# Altium project OlivettiISARiser.PrjPcb
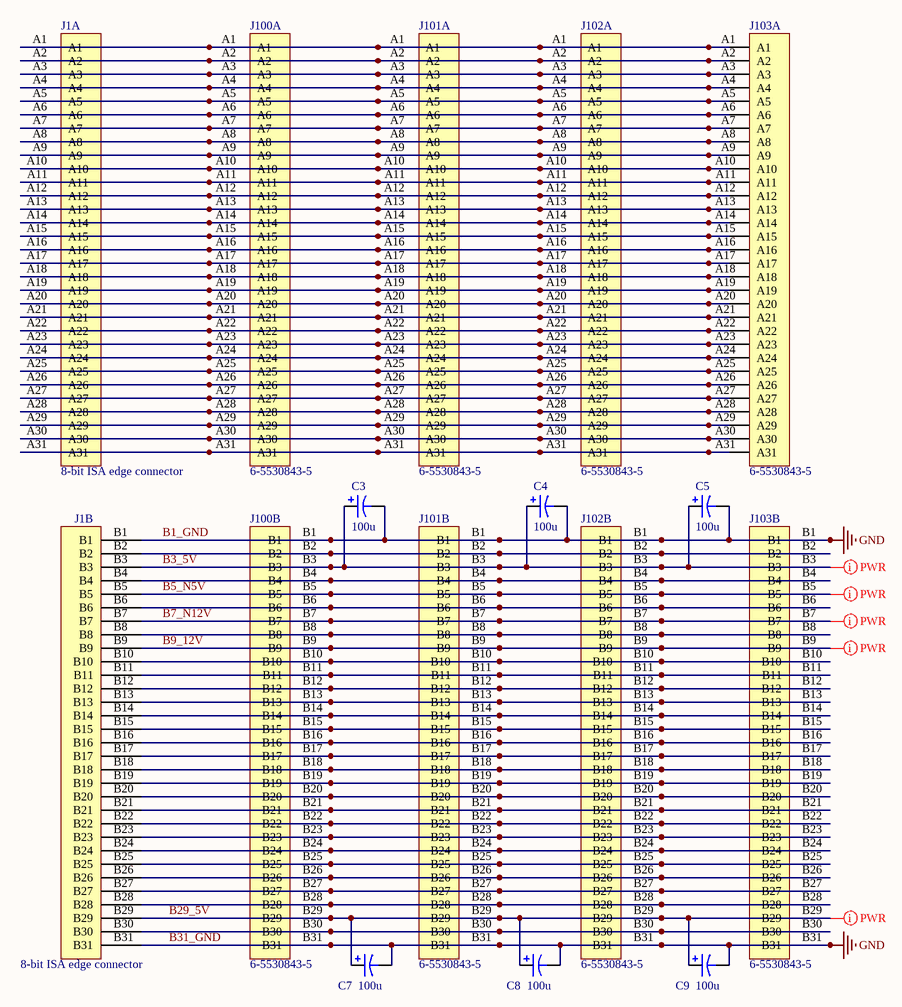
[diagram p0: Riser.SchDoc]
1 sheet, 11 parts. Net scope: global (net labels, ports and power ports of the same name join across sheets).
Board file: Riser.PcbDoc

## Sheet Riser.SchDoc
size A4; SheetNumber: 1; SheetTotal: 1

### Parts
C3  100u  [CAP-6.3-2.5]
C4  100u  [CAP-6.3-2.5]
C5  100u  [CAP-6.3-2.5]
C7  100u  [CAP-6.3-2.5]
C8  100u  [CAP-6.3-2.5]
C9  100u  [CAP-6.3-2.5]
J1  8-bit ISA edge connector  [ISA-EDGE-62]  (parts A,B of 2)  (no BOM)
J100  6-5530843-5  [CONN62_6-5530843-5_TEC]  (parts A,B of 2)
J101  6-5530843-5  [CONN62_6-5530843-5_TEC]  (parts A,B of 2)
J102  6-5530843-5  [CONN62_6-5530843-5_TEC]  (parts A,B of 2)
J103  6-5530843-5  [CONN62_6-5530843-5_TEC]  (parts A,B of 2)

### Nets
B1_GND: C3.2 C4.2 C5.2 C7.2 C8.2 C9.2 J1.B1 J1.B31 J100.B1 J100.B31 J101.B1 J101.B31 J102.B1 J102.B31 J103.B1 J103.B31  [also labelled B31_GND, GND]
B3_5V: C3.1 C4.1 C5.1 J1.B3 J100.B3 J101.B3 J102.B3 J103.B3
B5_N5V: J1.B5 J100.B5 J101.B5 J102.B5 J103.B5
B7_N12V: J1.B7 J100.B7 J101.B7 J102.B7 J103.B7
B9_12V: J1.B9 J100.B9 J101.B9 J102.B9 J103.B9
B29_5V: C7.1 C8.1 C9.1 J1.B29 J100.B29 J101.B29 J102.B29 J103.B29
NetJ1_A1: J1.A1 J100.A1 J101.A1 J102.A1 J103.A1
NetJ1_A2: J1.A2 J100.A2 J101.A2 J102.A2 J103.A2
NetJ1_A3: J1.A3 J100.A3 J101.A3 J102.A3 J103.A3
NetJ1_A4: J1.A4 J100.A4 J101.A4 J102.A4 J103.A4
NetJ1_A5: J1.A5 J100.A5 J101.A5 J102.A5 J103.A5
NetJ1_A6: J1.A6 J100.A6 J101.A6 J102.A6 J103.A6
NetJ1_A7: J1.A7 J100.A7 J101.A7 J102.A7 J103.A7
NetJ1_A8: J1.A8 J100.A8 J101.A8 J102.A8 J103.A8
NetJ1_A9: J1.A9 J100.A9 J101.A9 J102.A9 J103.A9
NetJ1_A10: J1.A10 J100.A10 J101.A10 J102.A10 J103.A10
NetJ1_A11: J1.A11 J100.A11 J101.A11 J102.A11 J103.A11
NetJ1_A12: J1.A12 J100.A12 J101.A12 J102.A12 J103.A12
NetJ1_A13: J1.A13 J100.A13 J101.A13 J102.A13 J103.A13
NetJ1_A14: J1.A14 J100.A14 J101.A14 J102.A14 J103.A14
NetJ1_A15: J1.A15 J100.A15 J101.A15 J102.A15 J103.A15
NetJ1_A16: J1.A16 J100.A16 J101.A16 J102.A16 J103.A16
NetJ1_A17: J1.A17 J100.A17 J101.A17 J102.A17 J103.A17
NetJ1_A18: J1.A18 J100.A18 J101.A18 J102.A18 J103.A18
NetJ1_A19: J1.A19 J100.A19 J101.A19 J102.A19 J103.A19
NetJ1_A20: J1.A20 J100.A20 J101.A20 J102.A20 J103.A20
NetJ1_A21: J1.A21 J100.A21 J101.A21 J102.A21 J103.A21
NetJ1_A22: J1.A22 J100.A22 J101.A22 J102.A22 J103.A22
NetJ1_A23: J1.A23 J100.A23 J101.A23 J102.A23 J103.A23
NetJ1_A24: J1.A24 J100.A24 J101.A24 J102.A24 J103.A24
NetJ1_A25: J1.A25 J100.A25 J101.A25 J102.A25 J103.A25
NetJ1_A26: J1.A26 J100.A26 J101.A26 J102.A26 J103.A26
NetJ1_A27: J1.A27 J100.A27 J101.A27 J102.A27 J103.A27
NetJ1_A28: J1.A28 J100.A28 J101.A28 J102.A28 J103.A28
NetJ1_A29: J1.A29 J100.A29 J101.A29 J102.A29 J103.A29
NetJ1_A30: J1.A30 J100.A30 J101.A30 J102.A30 J103.A30
NetJ1_A31: J1.A31 J100.A31 J101.A31 J102.A31 J103.A31
NetJ1_B2: J1.B2 J100.B2 J101.B2 J102.B2 J103.B2
NetJ1_B4: J1.B4 J100.B4 J101.B4 J102.B4 J103.B4
NetJ1_B6: J1.B6 J100.B6 J101.B6 J102.B6 J103.B6
NetJ1_B8: J1.B8 J100.B8 J101.B8 J102.B8 J103.B8
NetJ1_B10: J1.B10 J100.B10 J101.B10 J102.B10 J103.B10
NetJ1_B11: J1.B11 J100.B11 J101.B11 J102.B11 J103.B11
NetJ1_B12: J1.B12 J100.B12 J101.B12 J102.B12 J103.B12
NetJ1_B13: J1.B13 J100.B13 J101.B13 J102.B13 J103.B13
NetJ1_B14: J1.B14 J100.B14 J101.B14 J102.B14 J103.B14
NetJ1_B15: J1.B15 J100.B15 J101.B15 J102.B15 J103.B15
NetJ1_B16: J1.B16 J100.B16 J101.B16 J102.B16 J103.B16
NetJ1_B17: J1.B17 J100.B17 J101.B17 J102.B17 J103.B17
NetJ1_B18: J1.B18 J100.B18 J101.B18 J102.B18 J103.B18
NetJ1_B19: J1.B19 J100.B19 J101.B19 J102.B19 J103.B19
NetJ1_B20: J1.B20 J100.B20 J101.B20 J102.B20 J103.B20
NetJ1_B21: J1.B21 J100.B21 J101.B21 J102.B21 J103.B21
NetJ1_B22: J1.B22 J100.B22 J101.B22 J102.B22 J103.B22
NetJ1_B23: J1.B23 J100.B23 J101.B23 J102.B23 J103.B23
NetJ1_B24: J1.B24 J100.B24 J101.B24 J102.B24 J103.B24
NetJ1_B25: J1.B25 J100.B25 J101.B25 J102.B25 J103.B25
NetJ1_B26: J1.B26 J100.B26 J101.B26 J102.B26 J103.B26
NetJ1_B27: J1.B27 J100.B27 J101.B27 J102.B27 J103.B27
NetJ1_B28: J1.B28 J100.B28 J101.B28 J102.B28 J103.B28
NetJ1_B30: J1.B30 J100.B30 J101.B30 J102.B30 J103.B30

### Layout directives
net class PWR: B3_5V, B5_N5V, B7_N12V, B9_12V, B29_5V

### Library data of the parts
C3-C5 C7-C9 = Cap Pol1: Polarized Capacitor (Radial); Published: 8-Jun-2000; LatestRevisionDate: 17-Jul-2002; LatestRevisionNote: Re-released for DXP Platform.; PackageReference: RB7.6-15; Publisher: Altium Limited; PackageDescription: Polarized Capacitor (Radial); 2 Leads; Value: 100u
J1 = ISA-EDGE-62
J100-J103 = 6-5530843-5: No Description Available